# Altium schematic sheet [SH][SFW1] V1.0.SchDoc
size A4
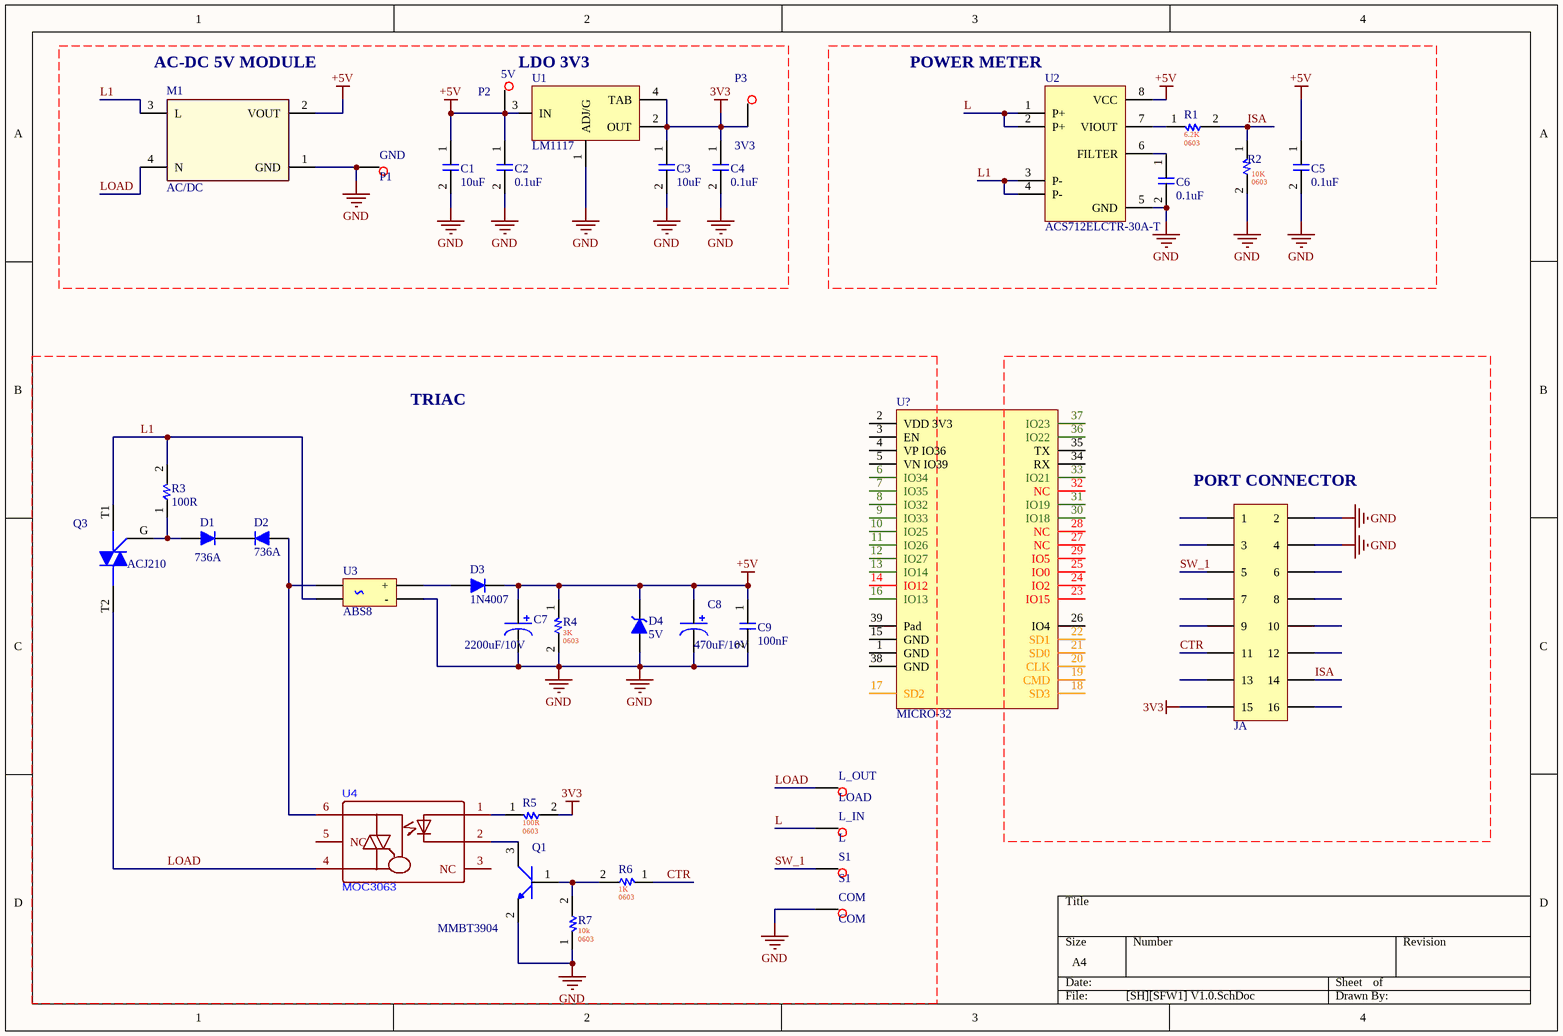
[diagram p0: [SH][SFW1] V1.0.SchDoc]

## Parts
3V3  P3  [TEXT_POINT]
5V  P2  [TEXT_POINT]
C1  10uF  [0805 C]
C2  0.1uF  [0603 C]
C3  10uF  [0805 C]
C4  0.1uF  [0603 C]
C5  0.1uF  [0603 C]
C6  0.1uF  [0603 C]
C7  2200uF/10V  [CAPAP 8X11.5 P3.5]
C8  470uF/10V  [CAPAE 5X9 P2 ORANGE]
C9  100nF  [0603 C]
COM  COM  [P1]
D1  736A  [DO214AC]
D2  736A  [DO214AC]
D3  1N4007  [SOD-323]
D4  5V  [SOD-80C]
GND  P1  [TEXT_POINT]
JA  rao doi  [T]  (value not drawn)
L_IN  L  [P1]
L_OUT  LOAD  [P1]
M1  AC/DC  [AC-DC 5V K4H24]
Q1  MMBT3904  [SOT 23-3]
Q3  ACJ210  [TO_252]
R1  value 6.2K  FP: 0603  [0603 R]  (hidden comment: 3K)
R2  value 10K  FP: 0603  [0603 R]  (hidden comment: 3K)
R3  100R  [0805 R]
R4  FP: 0603  [0603 R]  (hidden comment: 3K)
R5  FP: 0603  [0603 R]  (hidden comment: 100R)
R6  FP: 0603  [0603 R]  (hidden comment: 1K)
R7  FP: 0603  [0603 R]  (hidden comment: 10k)
S1  S1  [P1]
U1  LM1117  [SOT23-4]
U2  ACS712ELCTR-30A-T  [SOIC 8]
U3  ABS8  [4PIN SOP]
U4  MOC3063  [TO252]
U?  MICRO-32  [ESP MICRO 32]

## Nets
3V3: 3V3.1(P) C3.1 C4.1 JA.15 R5.2 U1.2(OUT) U1.4(TAB)
+5V: 5V.1(P) C1.1 C2.1 C5.1 C7.1 C8.1 C9.1 D3.2 D4.2 M1.2(VOUT) R4.1 U1.3(IN) U2.8(VCC)
GND: C1.2 C2.2 C3.2 C4.2 C5.2 C6.2 C7.2 C8.2 C9.2 COM.1(P) D4.1 GND.1(P) JA.2 JA.4 M1.1(GND) Q1.2(E) R2.2 R4.2 R7.1 U1.1(ADJ/G) U2.5(GND) U3.2(-)
CTR: JA.11 R6.1
ISA: JA.14 R1.2 R2.1
L: L_IN.1(P) U2.1(P+) U2.2(P+)
L1: M1.3(L) Q3.T1 R3.2 U2.3(P-) U2.4(P-) U3.4
LOAD: L_OUT.1(P) M1.4(N) Q3.T2 U4.4(MT)
SW_1: JA.5 S1.1(P)
NetC6_1: C6.1 U2.6(FILTER)
NetD1_1: D1.1 Q3.G R3.1
NetD1_2: D1.2 D2.2
NetD2_1: D2.1 U3.3 U4.6(MT)
NetD3_1: D3.1 U3.1(+)
NetQ1_1: Q1.1(B) R6.2 R7.2
NetQ1_3: Q1.3(C) U4.2(CAT)
NetR1_1: R1.1 U2.7(VIOUT)
NetR5_1: R5.1 U4.1(AN)

Not connected (* = marked no-connect by the designer): JA 1 3 6 7 8 9 10 12 13 16; U4 3(NC) 5(NC); U? 1(GND) 2(VDD_3V3) 3(EN) 4(VP_IO36) 5(VN_IO39) 6(IO34) 7(IO35) 8(IO32) 9(IO33) 10(IO25) 11(IO26) 12(IO27) 13(IO14) 14(IO12) 15(GND) 16(IO13) 17(SD2) 18(SD3) 19(CMD) 20(CLK) 21(SD0) 22(SD1) 23(IO15) 24(IO2) 25(IO0) 26(IO4) 27(NC) 28(NC) 29(IO5) 30(IO18) 31(IO19) 32(NC) 33(IO21) 34(RX) 35(TX) 36(IO22) 37(IO23) 38(GND) 39(Pad)

## Notes on the sheet
- (near M1) AC-DC 5V MODULE
- LDO 3V3
- (near U2) POWER METER
- TRIAC
- (near JA) PORT CONNECTOR

## Library data of the parts
3V3 5V COM L_IN L_OUT S1 = P1
C1-C6 C9 = CAP NOP: PN: *
C7 C8 = CAP POLAR
D1-D3 = Diode schottky: PN: *
D4 = Diode Zener: Editor: MMUOP; Value: *; PN: *
JA = P2x8
Q1 = TRANS NPN: Bipolar (BJT) Transistor NPN 40 V 200 mA 300MHz 350 mW Surface Mount SOT-23-3 (TO-236)
Q3 = TRIAC
R1 R2 R4 = 0603 10k 1%: 3K1% 0603 SMD; PN: C98220; VOLTAGE + TOLE: 1%; PACKAGE: SMD; DATE: 04-Mar-21; CREATOR: MMUOP; ComponentLink1Description: New link; ComponentLink1URL: *
  R4: VALUE: 3K
R3 = Res SMD
R5 = 0603 10k 1%: 100R 1% 0603 SMD; PN: C98220; PACKAGE: SMD; DATE: 04-Mar-21; CREATOR: MMUOP; ComponentLink1Description: New link; ComponentLink1URL: *; VOLTAGE + TOLE: 1%; VALUE: 100R
R6 R7 = 0603 10k 1%: 10k 1% 0603 SMD; PN: C98220; PACKAGE: SMD; DATE: 04-Mar-21; CREATOR: MMUOP; ComponentLink1Description: New link; ComponentLink1URL: *; VOLTAGE + TOLE: 1%
  R6: VALUE: 1K
  R7: VALUE: 10k
U2 = ACS71240: ACS712ELCTR-20A  SOIC 8; ComponentLink1Description: New link; ComponentLink1URL: https://banlinhkiendientu.vn/acs712t/
U3 = DIODE BRIGH
U4 = CYMOC3063
U? = ESP MICRO-32: Bluetooth, WiFi 802.11b/g/n, Bluetooth v4.2 +EDR Transceiver Module 2.4GHz ~ 2.5GHz Antenna Not Included, I-PEX Surface Mount